# Altium schematic sheet 12_TO_3V3_VOLTAGE_DIVIDER.SchDoc
size A4
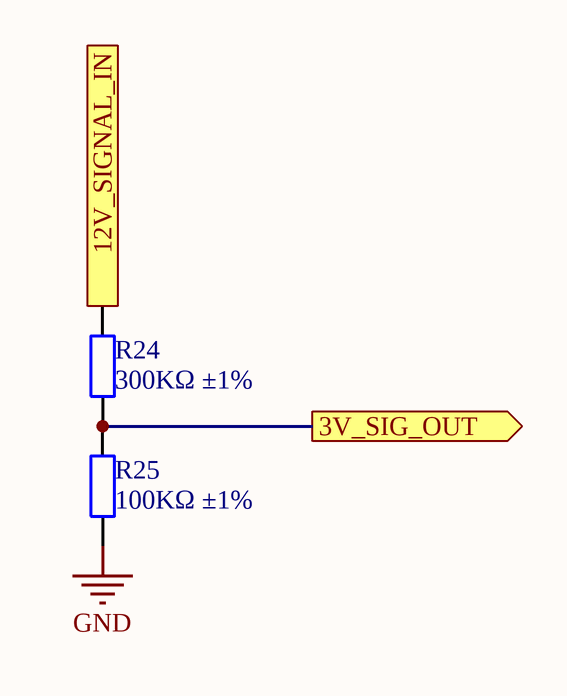
[diagram p0: 12_TO_3V3_VOLTAGE_DIVIDER.SchDoc]

## Parts
R24  300KΩ ±1%  [0402_R]
R25  100KΩ ±1%  [0402_R]

## Ports
3V_SIG_OUT (out), 12V_SIGNAL_IN

## Nets
GND: R25.1
3V_SIG_OUT: R24.1 R25.2 ; port 3V_SIG_OUT
12V_SIGNAL_IN: R24.2 ; port 12V_SIGNAL_IN

## Library data of the parts
R24 = 0402 300K (3003) 1%: Chip resistor; Manufacturer: Uniroyal Elec; PartNumber: 0402WGF3003TCE; Power: 1/16W; ComponentLink1Description: Supplier link; ComponentLink1URL: http://www.szlcsc.com/product/details_26517.html; Package: 0402; Supplier: LC; SuppliersPartNumber: C25774; Resistance: 300KΩ; Tolerance: 1%
R25 = 0402 100K (1003) 1%: Chip resistor; Manufacturer: Uniroyal Elec; PartNumber: 0402WGF1003TCE; Power: 1/16W; ComponentLink1Description: Supplier link; ComponentLink1URL: http://www.szlcsc.com/product/details_26484.html; Package: 0402; Supplier: LC; SuppliersPartNumber: C25741; Resistance: 100KΩ; Tolerance: 1%